# EAGLE schematic Driver_PaP (EAGLE 7.2.0)
CDESIGNER: Apellido, Nombre; CNAME: DRIVER DE MOTOR PASO A PASO; CREVISION: 1.0; CSCHO: ESCUELA
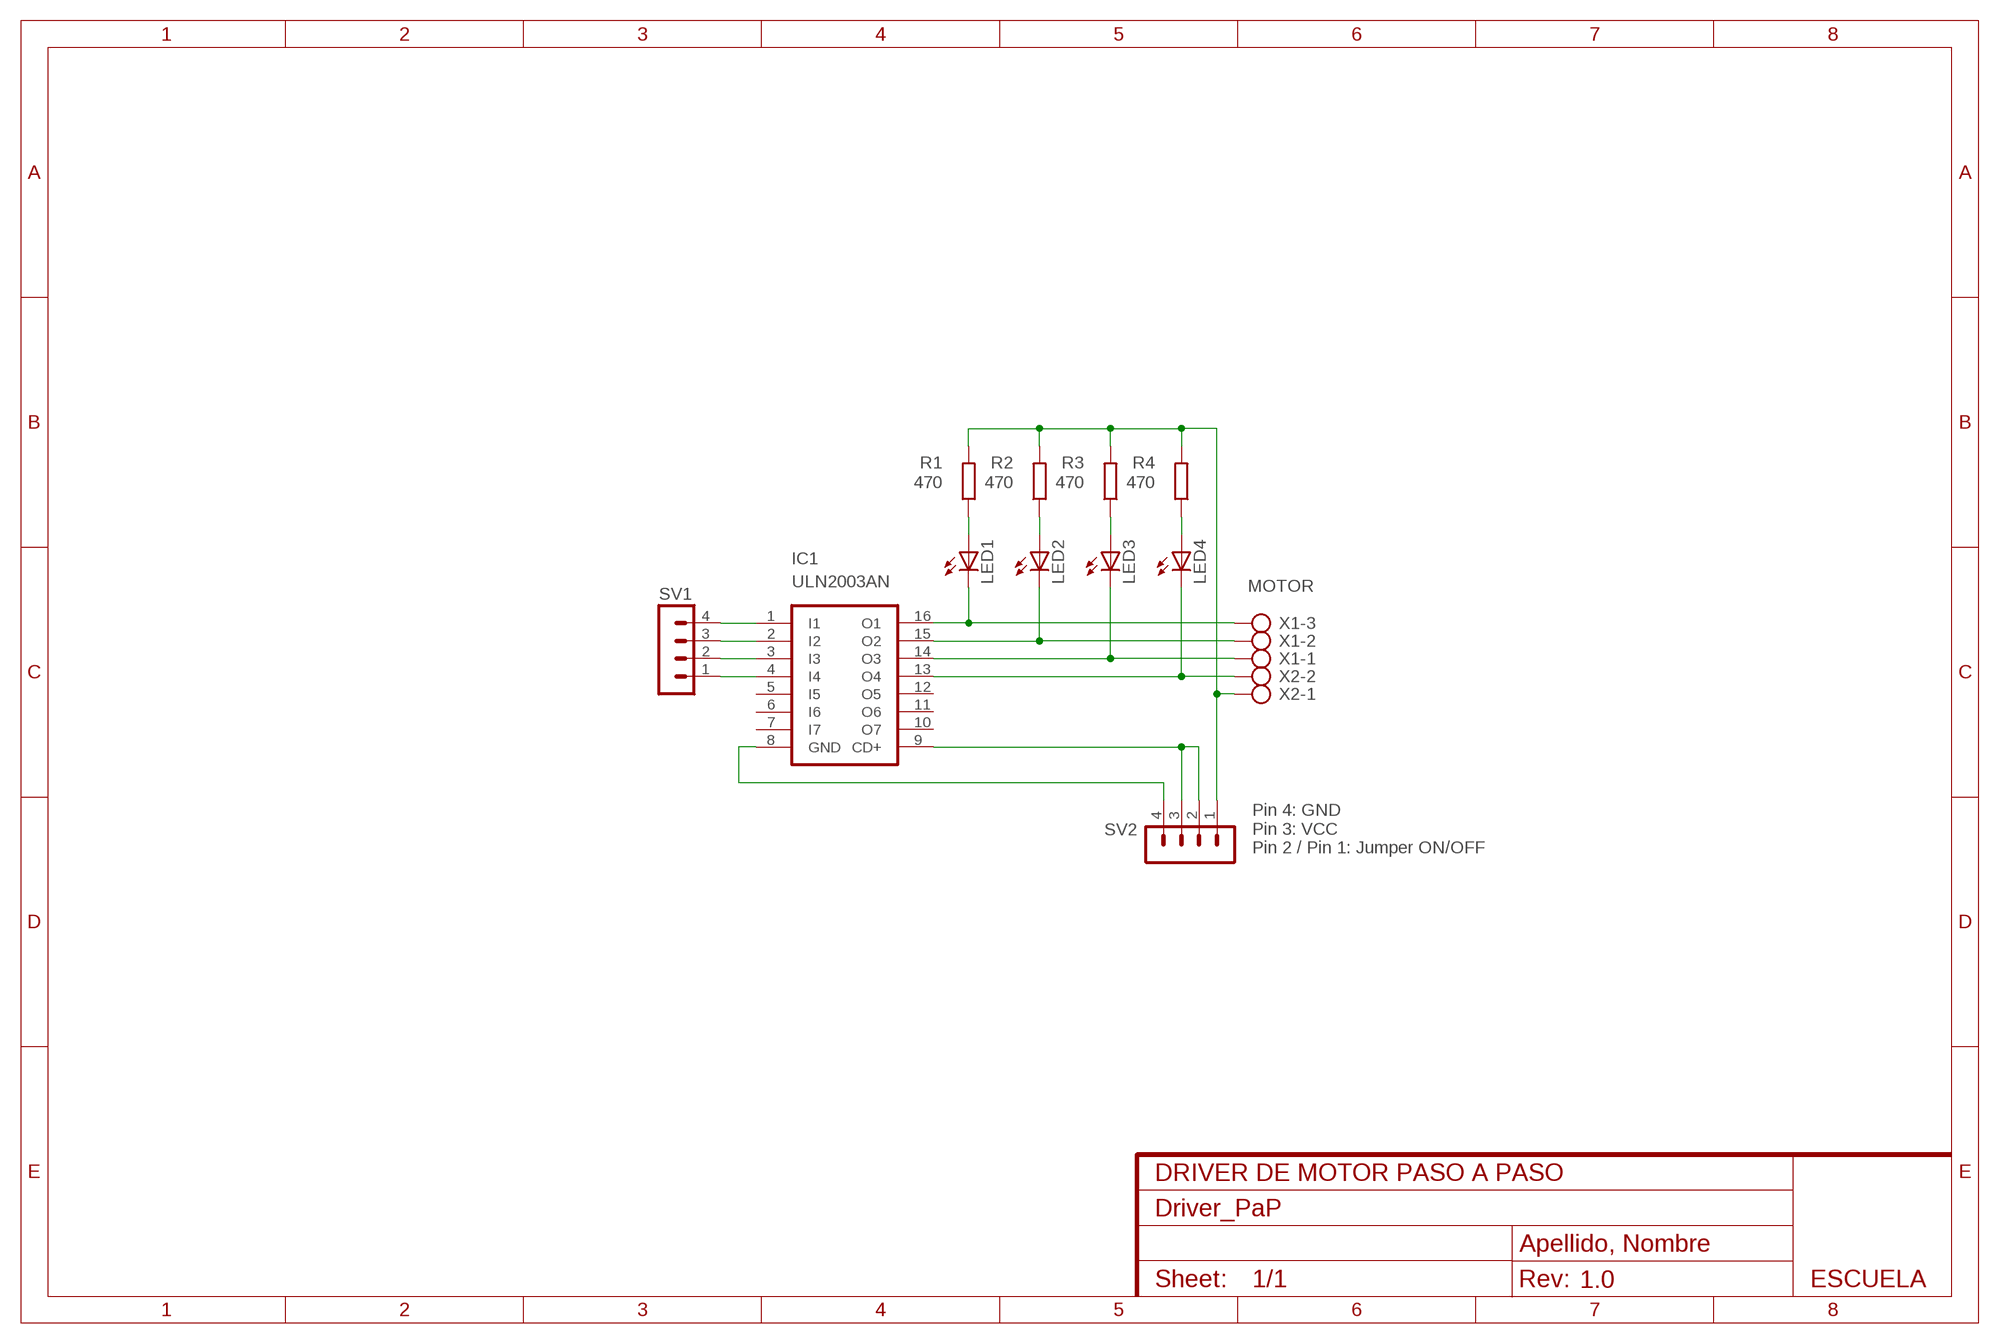
[diagram p0: schematic, sheet 1]

## Parts
IC1  ULN2003AN  [DIL16]
LED1  LED3MM  [LED_3MM]
LED2  LED3MM  [LED_3MM]
LED3  LED3MM  [LED_3MM]
LED4  LED3MM  [LED_3MM]
R1  470  RESISTOR-EU0204/7  [0204/7]
R2  470  RESISTOR-EU0204/7  [0204/7]
R3  470  RESISTOR-EU0204/7  [0204/7]
R4  470  RESISTOR-EU0204/7  [0204/7]
SV1  MA04-1  [MA04-1]
SV2  PWR  MA04-1  [MA04-1]
X1  MOTOR  BORNERA_AK500/3  [AK500/3]
X2  BORNERA_AK500/2  [AK500/2]

## Nets
N$1: IC1.1(I1) SV1.4
N$2: IC1.2(I2) SV1.3
N$3: IC1.3(I3) SV1.2
N$4: IC1.4(I4) SV1.1
N$5: LED1.A R1.1
N$6: LED2.A R2.1
N$7: LED3.A R3.1
N$8: LED4.A R4.1
N$9: IC1.16(O1) LED1.K(C) X1.3
N$10: IC1.15(O2) LED2.K(C) X1.2
N$11: IC1.14(O3) LED3.K(C) X1.1
N$12: IC1.13(O4) LED4.K(C) X2.2
N$13: R1.2 R2.2 R3.2 R4.2 SV2.1 X2.1
N$14: IC1.8(GND) SV2.4
N$15: IC1.9(CD+) SV2.2 SV2.3
Unconnected: IC1.5(I5) IC1.6(I6) IC1.7(I7) IC1.10(O7) IC1.11(O6) IC1.12(O5)

## Notes on the sheet
- Pin 4: GND
  Pin 3: VCC
  Pin 2 / Pin 1: Jumper ON/OFF

## Library data of the parts
IC1 = uln-udn:ULN2003A: DRIVER ARRAY
LED1-LED4 = treser_lib:LED: LEDs
R1-R4 = treser_lib:RESISTOR-EU: Resistor Simbolo europeo.
SV1 SV2 = con-lstb:MA04-1: PIN HEADER; OC_FARNELL: unknown; OC_NEWARK: unknown
X1 = treser_lib:BORNERA_AK500/3: Bornera de tornillo; OC_FARNELL: unknown; OC_NEWARK: unknown
X2 = treser_lib:BORNERA_AK500/2: Bornera de tornillo; OC_FARNELL: unknown; OC_NEWARK: unknown